# Altium project main_mini.PrjPcb
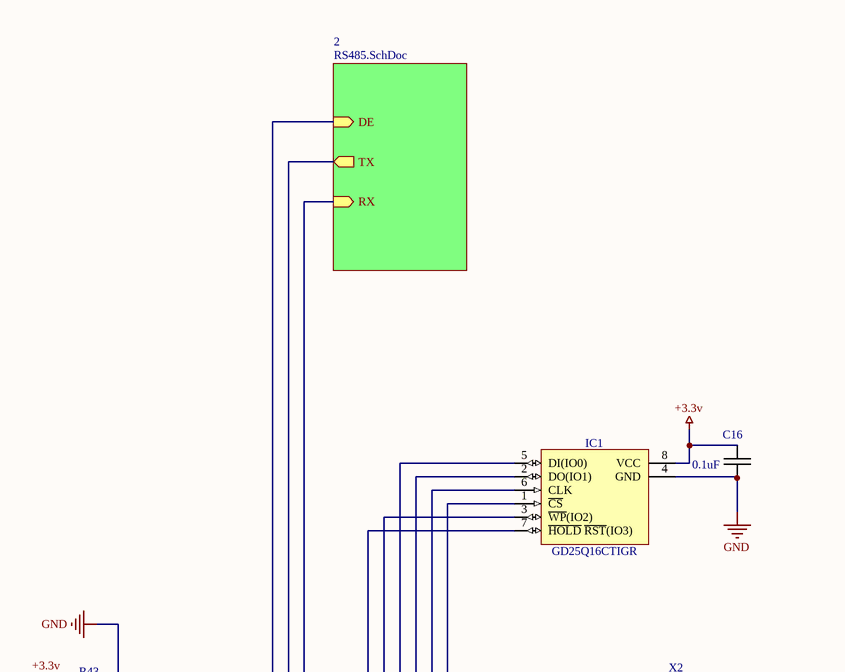
[diagram p0: main_mini.SchDoc, top left]
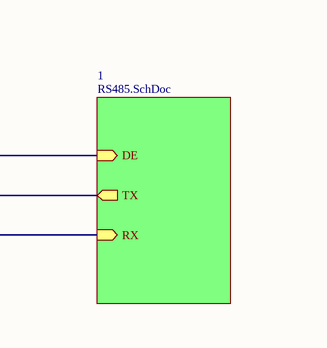
[diagram p1: main_mini.SchDoc, top right]
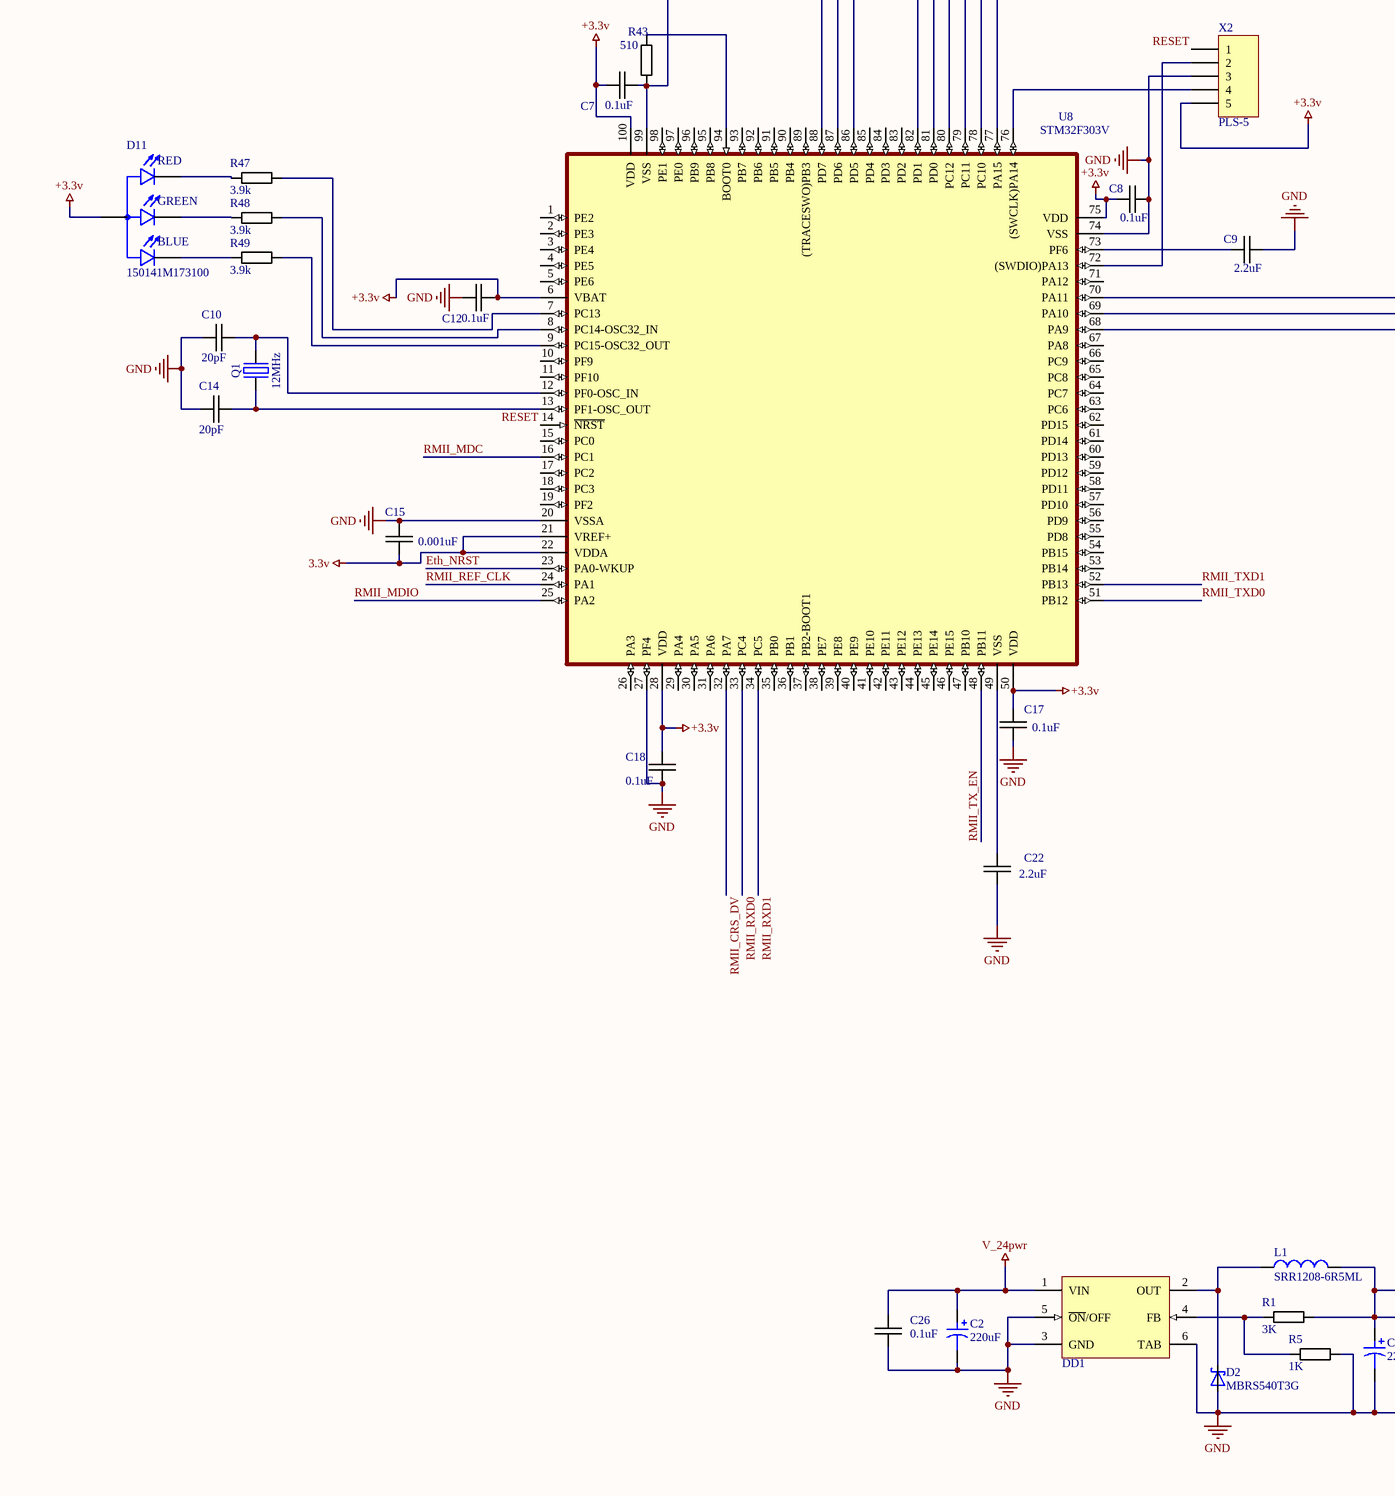
[diagram p2: main_mini.SchDoc, bottom left]
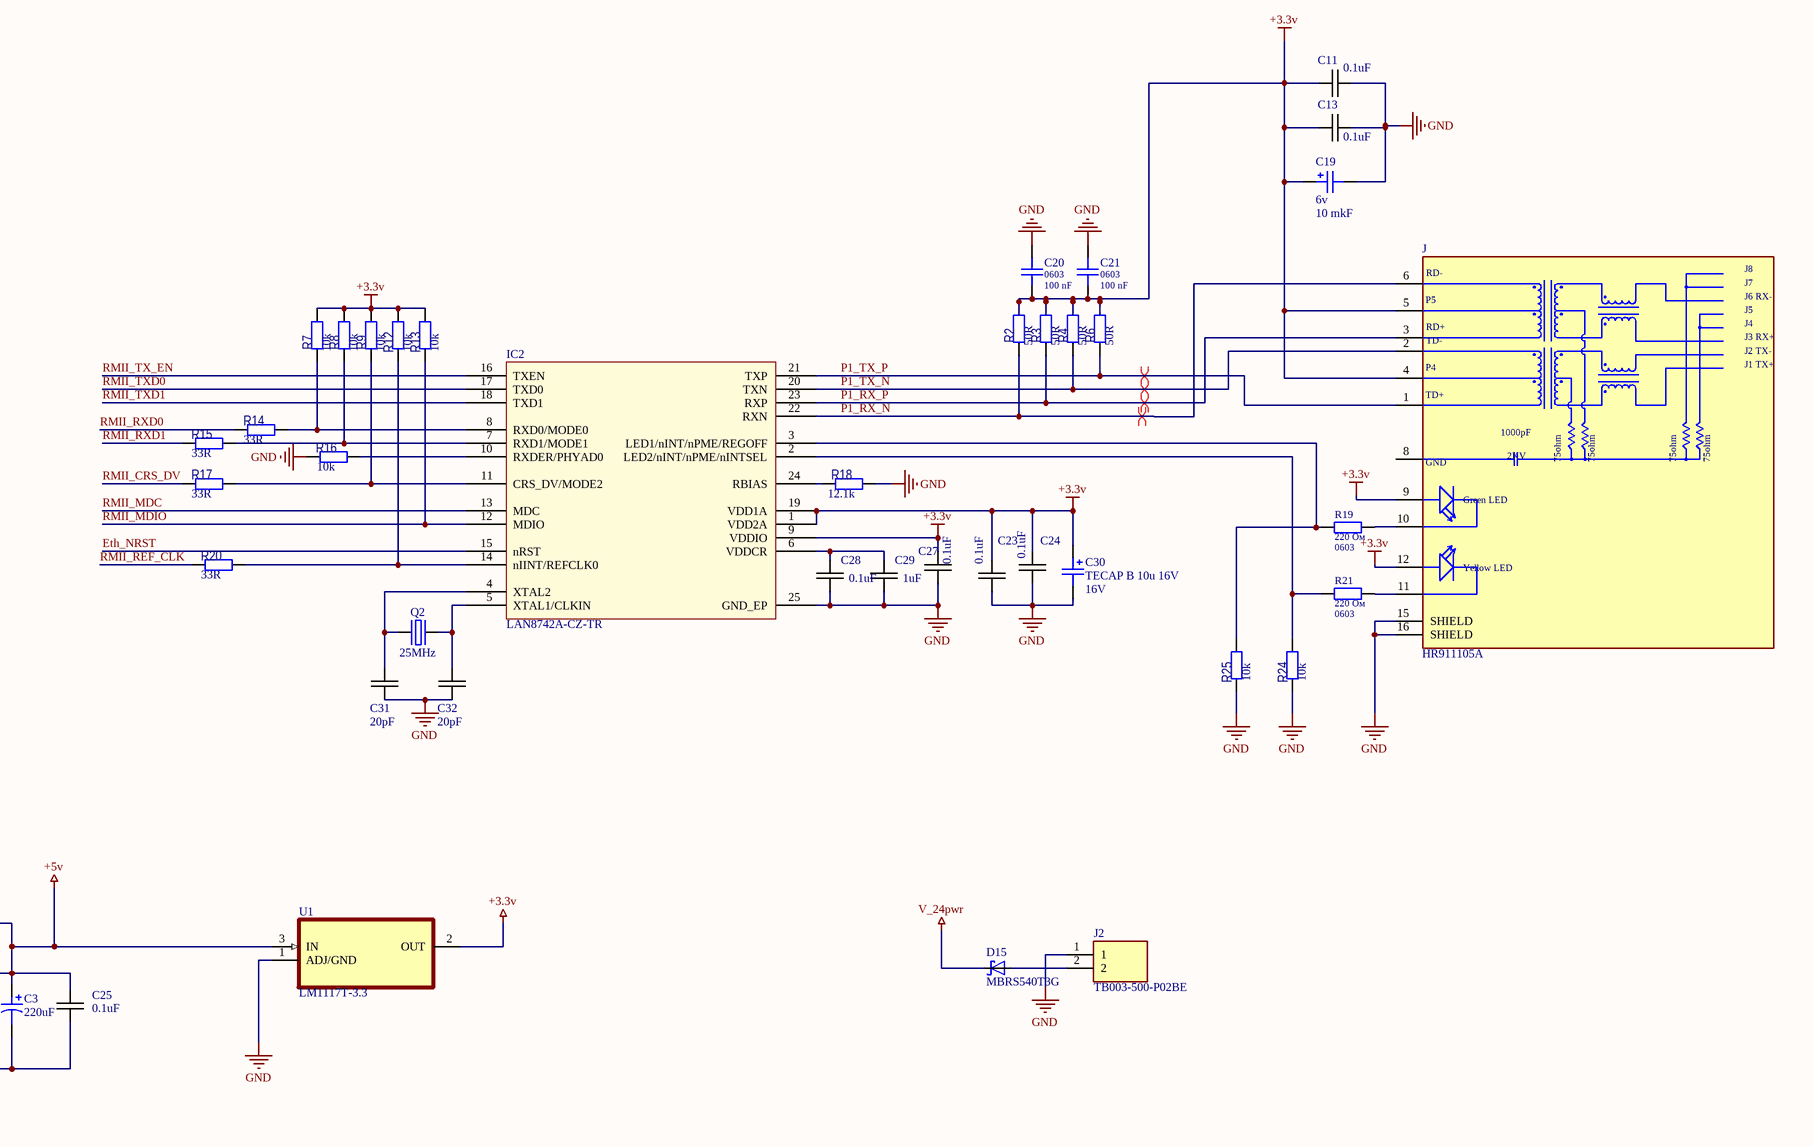
[diagram p3: main_mini.SchDoc, bottom right]
2 sheets, 97 parts. Net scope: hierarchical (ports join the sheet entries above them; power ports are global).
Board file: main_mini.PcbDoc
Sheets:
  main_mini.SchDoc
    2 = RS485.SchDoc
    1 = RS485.SchDoc

## Sheet main_mini.SchDoc
size A1

### Parts
C2  value 220uF  [ECR 10x13mm]  (hidden comment: 220uF 50v)
C3  value 220uF  [ECR 10x13mm]  (hidden comment: 220uF 50v)
C7  0.1uF  [CAPACITOR 0603]
C8  0.1uF  [CAPACITOR 0603]
C9  2.2uF  [CAPACITOR 0805]
C10  20pF  [CAPACITOR 0603]
C11  0.1uF  [CAPACITOR 0603]
C12  0.1uF  [CAPACITOR 0603]
C13  0.1uF  [CAPACITOR 0603]
C14  20pF  [CAPACITOR 0603]
C15  0.001uF  [CAPACITOR 0603]
C16  0.1uF  [CAPACITOR 0603]
C17  0.1uF  [CAPACITOR 0603]
C18  0.1uF  [CAPACITOR 0603]
C19  value 10 mkF  Voltage: 6v  [TECAP B]  (hidden comment: Cap T)
C20  Type: 0603  [CAPCHIP0603]  (hidden comment: 100 nF)
C21  Type: 0603  [CAPCHIP0603]  (hidden comment: 100 nF)
C22  2.2uF  [CAPACITOR 0805]
C23  0.1uF  [CAPACITOR 0603]
C24  0.1uF  [CAPACITOR 0603]
C25  0.1uF  [CAPACITOR 0603]
C26  0.1uF  [CAPACITOR 0603]
C27  0.1uF  [CAPACITOR 0603]
C28  0.1uF  [CAPACITOR 0603]
C29  1uF  [CAPACITOR 0603]
C30  Voltage: 16V  [TECAP B]  (hidden comment: TECAP B 10u 16V)
C31  20pF  [CAPACITOR 0603]
C32  20pF  [CAPACITOR 0603]
D2  MBRS540T3G  [DIOM7958X213N]
D11  150141M173100  [LED_150141M173100]
D15  MBRS540T3G  [DIOM7958X213N]
DD1  LM2596S-ADJ  [TO-263]  (value not drawn)
IC1  GD25Q16CTIGR  [NSO8]
IC2  LAN8742A-CZ-TR  [LAN8742A]
J  HR911105A  [HANRUN_HR911105A]
J2  TB003-500-P02BE  [CUI_TB003-500-P02BE]
L1  SRR1208-6R5ML  [SRR1208]
Q1  12MHz  [HC49SM]
Q2  25MHz  [HC49SM]
R1  3K  [Resistor 0603]
R2  50R  [RESCHIP0603]
R3  50R  [RESCHIP0603]
R4  50R  [RESCHIP0603]
R5  1K  [Resistor 0603]
R6  50R  [RESCHIP0603]
R7  10k  [RESCHIP0603]
R8  10k  [RESCHIP0603]
R9  10k  [RESCHIP0603]
R12  10k  [RESCHIP0603]
R13  10k  [RESCHIP0603]
R14  33R  [RESCHIP0603]
R15  33R  [RESCHIP0603]
R16  10k  [RESCHIP0603]
R17  33R  [RESCHIP0603]
R18  12.1k  [RESCHIP0603]
R19  Type: 0603  [RESCHIP0603]  (hidden comment: 220 Ом)
R20  33R  [RESCHIP0603]
R21  Type: 0603  [RESCHIP0603]  (hidden comment: 220 Ом)
R24  10k  [RESCHIP0603]
R25  10k  [RESCHIP0603]
R43  510  [Resistor 0805]
R47  3.9k  [Resistor 0805]
R48  3.9k  [Resistor 0805]
R49  3.9k  [Resistor 0805]
U1  LM1117T-3.3  [TO254P470X1016X2222-3P]
U8  STM32F303V  [QFP50P1600X1600X160-100N]
X2  PLS-5  [PLS-5-3D]

### Sub-sheets
1 = RS485.SchDoc: DE (in), TX (out), RX (in)
2 = RS485.SchDoc: DE (in), TX (out), RX (in)

### Nets
3.3v: C15.2 U8.21(VREF+) U8.22(VDDA)
+3.3v: C7.1 C8.1 C11.1 C12.2 C13.1 C16.1 C17.1 C18.1 C19.1 C20.1 C21.1 C23.1 C24.2 C27.1 C30.1 D11.1(A) IC1.8(VCC) IC2.1(VDD2A) IC2.9(VDDIO) IC2.19(VDD1A) J.4(P4) J.5(P5) J.9(GA) J.12(YA) R2.2 R3.2 R4.2 R6.2 R7.2 R8.2 R9.2 R12.2 R13.2 U1.2(OUT) U8.6(VBAT) U8.28(VDD) U8.50(VDD) U8.75(VDD) U8.100(VDD) X2.5
+5v: C3.1 C25.2 L1.P$2 R1.2 U1.3(IN)
GND: C2.2 C3.2 C7.2 C8.2 C9.2 C10.1 C11.2 C12.1 C13.2 C14.1 C15.1 C16.2 C17.2 C18.2 C19.2 C20.2 C21.2 C22.1 C23.2 C24.1 C25.1 C26.1 C27.2 C28.2 C29.2 C30.2 C31.1 C32.1 D2.A DD1.3(GND) DD1.5(~{ON}/OFF) DD1.6(TAB) IC1.4(GND) IC2.25(GND_EP) J.15(SHIELD) J.16(SHIELD) J2.1 R5.2 R16.1 R18.2 R24.1 R25.1 R43.2 U1.1(ADJ/GND) U8.20(VSSA) U8.27(PF4) U8.74(VSS) U8.99(VSS) X2.3
V_24pwr: C2.1 C26.2 D15.C DD1.1(VIN)
Eth_NRST: IC2.15(nRST) U8.23(PA0-WKUP)
P1_RX_N: IC2.22(RXN) J.6(RD-) R2.1
P1_RX_P: IC2.23(RXP) J.3(RD+) R3.1
P1_TX_N: IC2.20(TXN) J.2(TD-) R4.1
P1_TX_P: IC2.21(TXP) J.1(TD+) R6.1
RESET: U8.14(~{NRST}) X2.1
RMII_CRS_DV: R17.1 U8.32(PA7)
RMII_MDC: IC2.13(MDC) U8.16(PC1)
RMII_MDIO: IC2.12(MDIO) R13.1 U8.25(PA2)
RMII_REF_CLK: R20.1 U8.24(PA1)
RMII_RXD0: R14.1 U8.33(PC4)
RMII_RXD1: R15.1 U8.34(PC5)
RMII_TX_EN: IC2.16(TXEN) U8.48(PB11)
RMII_TXD0: IC2.17(TXD0) U8.51(PB12)
RMII_TXD1: IC2.18(TXD1) U8.52(PB13)
NetC9_1: C9.1 U8.73(PF6)
NetC10_2: C10.2 Q1.2(OSC2) U8.12(PF0-OSC_IN)
NetC14_2: C14.2 Q1.1(OSC1) U8.13(PF1-OSC_OUT)
NetC22_2: C22.2 U8.49(VSS)
NetC28_1: C28.1 C29.1 IC2.6(VDDCR)
NetC31_2: C31.2 IC2.4(XTAL2) Q2.1(OSC1)
NetC32_2: C32.2 IC2.5(XTAL1/CLKIN) Q2.2(OSC2)
NetD2_C: D2.C DD1.2(OUT) L1.P$1
NetD11_2: D11.2(B_C) R49.2
NetD11_3: D11.3(R_C) R47.2
NetD11_4: D11.4(G_C) R48.2
NetD15_A: D15.A J2.2
NetDD1_4: DD1.4(FB) R1.1 R5.1
NetIC1_1: IC1.1(~{CS}) U8.77(PA15)
NetIC1_2: IC1.2(DO(IO1)) U8.79(PC11)
NetIC1_3: IC1.3(~{WP}(IO2)) U8.81(PD0)
NetIC1_5: IC1.5(DI(IO0)) U8.80(PC12)
NetIC1_6: IC1.6(CLK) U8.78(PC10)
NetIC1_7: IC1.7(~{HOLD}_~{RST}(IO3)) U8.82(PD1)
NetIC2_2: IC2.2(LED2/nINT/nPME/nINTSEL) R21.1 R24.2
NetIC2_3: IC2.3(LED1/nINT/nPME/REGOFF) R19.1 R25.2
NetIC2_7: IC2.7(RXD1/MODE1) R8.1 R15.2
NetIC2_8: IC2.8(RXD0/MODE0) R7.1 R14.2
NetIC2_10: IC2.10(RXDER/PHYAD0) R16.2
NetIC2_11: IC2.11(CRS_DV/MODE2) R9.1 R17.2
NetIC2_14: IC2.14(nIINT/REFCLK0) R12.1 R20.2
NetIC2_24: IC2.24(RBIAS) R18.1
NetISO1_1_4: U8.70(PA11) ; sheet 1/DE
NetISO1_1_5: U8.68(PA9) ; sheet 1/RX
NetISO1_1_6: U8.69(PA10) ; sheet 1/TX
NetISO1_2_4: U8.88(PD7) ; sheet 2/DE
NetISO1_2_5: U8.86(PD5) ; sheet 2/RX
NetISO1_2_6: U8.87(PD6) ; sheet 2/TX
NetJ_10: J.10(GC) R19.2
NetJ_11: J.11(YC) R21.2
NetR43_1: R43.1 U8.94(BOOT0)
NetR47_1: R47.1 U8.7(PC13)
NetR48_1: R48.1 U8.8(PC14-OSC32_IN)
NetR49_1: R49.1 U8.9(PC15-OSC32_OUT)
NetU8_72: U8.72((SWDIO)PA13) X2.2
NetU8_76: U8.76((SWCLK)PA14) X2.4

Not connected (* = marked no-connect by the designer): J 8(GND); U8 1(PE2) 2(PE3) 3(PE4) 4(PE5) 5(PE6) 10(PF9) 11(PF10) 15(PC0) 17(PC2) 18(PC3) 19(PF2) 26(PA3) 29(PA4) 30(PA5) 31(PA6) 35(PB0) 36(PB1) 37(PB2-BOOT1) 38(PE7) 39(PE8) 40(PE9) 41(PE10) 42(PE11) 43(PE12) 44(PE13) 45(PE14) 46(PE15) 47(PB10) 53(PB14) 54(PB15) 55(PD8) 56(PD9) 57(PD10) 58(PD11) 59(PD12) 60(PD13) 61(PD14) 62(PD15) 63(PC6) 64(PC7) 65(PC8) 66(PC9) 67(PA8) 71(PA12) 83(PD2) 84(PD3) 85(PD4) 89((TRACESWO)PB3) 90(PB4) 91(PB5) 92(PB6) 93(PB7) 95(PB8) 96(PB9) 97(PE0) 98(PE1)

### Layout directives
differential pair: P1_RX_N, P1_RX_P, P1_TX_N, P1_TX_P

### Notes on the sheet
- (in symbol 150141M173100) RED; GREEN; BLUE
- (in symbol HR911105A) J8; J7; J6 RX-; J5; J4; J3 RX+; J2 TX-; J1 TX+; 1000pF; 2KV; 75ohm; Green LED; Yellow LED

### Library data of the parts
C2 C3 = Cap Pol: Polarized Capacitor (Rad); Voltage: 50; Type: Type; URL: http://www.hitano.com.tw/PDF/ECR_081225.pdf
C7-C18 C22-C29 C31 C32 = Capasitor: Value: *
C19 C30 = Cap T: Solid Tantalum Surface Mount Capacitors
  C19: Type: Type
  C30: Value: TECAP B 10u 16V; Type: TECAP B
C20 C21 = Cap C: Керамическтй конденсатор SMD C0603; Value: 100 nF
D2 D15 = MBRS540T3G: Diode Schottky 40V 5A Surface Mount SMC; MF: ON Semiconductor; SnapEDA_Link: https://www.snapeda.com/parts/MBRS540T3G/ON%20Semiconductor/view-part/78777/?ref=snap; MP: MBRS540T3G; Availability: Unavailable; Price: None; Value: *; Package: DO-214 ON Semiconductor
D11 = 150141M173100: Red, Green, Blue _RGB_ 625nm Red, 520nm Green, 470nm Blue LED Indication - Discrete 2V Red, 3.2V Green, 3.2V Blue 1411 _3528 Metric_; MF: Wurth Electronics; SnapEDA_Link: https://www.snapeda.com/parts/150141M173100/Wurth%20Electronics%20Inc./view-part/281733/?ref=snap; Price: None; MP: 150141M173100; Package: 1411 WÃ¼rth Elektronik; Value: *; Availability: Unavailable
DD1 = LM2596S-ADJ: SIMPLE SWITCHER® Power Converter 150 KHz 3A Step-Down Voltage Regulator, 5-pin TO-263; Manufacturer: National Semiconductor; Published: 13.04.2012; Publisher: Reukov A.V.; PartNumber: LM2596S-ADJ; CompType: Switcher; ComponentLink1URL: http://www.national.com/ds/LM/LM2596.pdf; ComponentLink2URL: http://www.national.com/pf/LM/LM2596.html; ComponentLink3URL: http://www.national.com/packaging/folders/ts5b.html
IC1 = W25Q128FVEIG: 128M-bit Serial Flash Memory with uniform 4KB sectors and Dual/Quad SPI and QPI
J = HR911105A: HR911105A Ethernet Interface Arduino Platform Evaluation Expansion Board; MF: DFRobot; Package: None; Availability: Unavailable; MP: HR911105A; Value: *; SnapEDA_Link: https://www.snapeda.com/parts/HR911105A/DFRobot/view-part/214807/?ref=snap; Price: None
J2 = TB003-500-P02BE: 2~24 Poles, Screw Type, Horizontal, 5.0 Pitch, 26~14 _AWG_, Terminal Block Connector; MF: CUI Devices; MP: TB003-500-P02BE; Availability: Unavailable; Package: None; SnapEDA_Link: https://www.snapeda.com/parts/TB003-500-P02BE/CUI%20Devices/view-part/3590637/?ref=snap; Price: None; Value: *
L1 = SRR1208-6R5ML: 6.5ÂµH Shielded Wirewound Inductor 6A 18mOhm Max Nonstandard; MF: Bourns; Availability: Unavailable; SnapEDA_Link: https://www.snapeda.com/parts/SRR1208-6R5ML/Bourns/view-part/353452/?ref=snap; Value: *; Package: Nonstandard Bourns; MP: SRR1208-6R5ML; Price: None
Q1 Q2 = Quartz Crystal
R1 R5 R43 R47-R49 = Resistor: Value: *
R2-R4 R6-R9 R12-R18 R20 R24 R25 = Res: Резистор; Tolerance_Percent: {Tolerance_Percent}; Class: Электронные компоненты; SubClass: Резисторы; Power_W: {Power_W}; Installation: {Installation}; Ordering_Information: {Ordering_Information}; Body: {Body}; Pins: 2
  R2-R4 R6: Value: 50R
  R7-R9 R12 R13 R16 R24 R25: Value: 10k
  R14 R15 R17 R20: Value: 33R
  R18: Value: 12.1k
R19 R21 = Res: Резистор SMD R0603; Tolerance: %; PWR: Value; Value: 220 Ом
U1 = LM1117T-3.3: Linear Voltage Regulator IC 1 Output 800mA TO-220-3; MF: Texas Instruments; MP: LM1117T-3.3; Price: None; Availability: Unavailable; Package: TO-220 Texas Instruments; SnapEDA_Link: https://www.snapeda.com/parts/LM1117T-3.3/Texas%20Instruments/view-part/103788/?ref=snap; Value: *
U8 = STM32F303V: ARMÂ® CortexÂ®-M4 STM32F3 Microcontroller IC 32-Bit 72MHz 100-LQFP (14x14); MF: STMicroelectronics; Price: None; Value: *; Availability: Unavailable; Package: LQFP-100 STMicroelectronics; MP: STM32F303V
X2 = PLS-5: Header, 5-Pin; LatestRevisionDate: 17-Jul-2002; LatestRevisionNote: Re-released for DXP Platform.; Publisher: Altium Limited

## Sheet RS485.SchDoc
size A1
Used 2 times, as channels 2, 1. Parts and nets are listed once, with the designators drawn on the sheet.
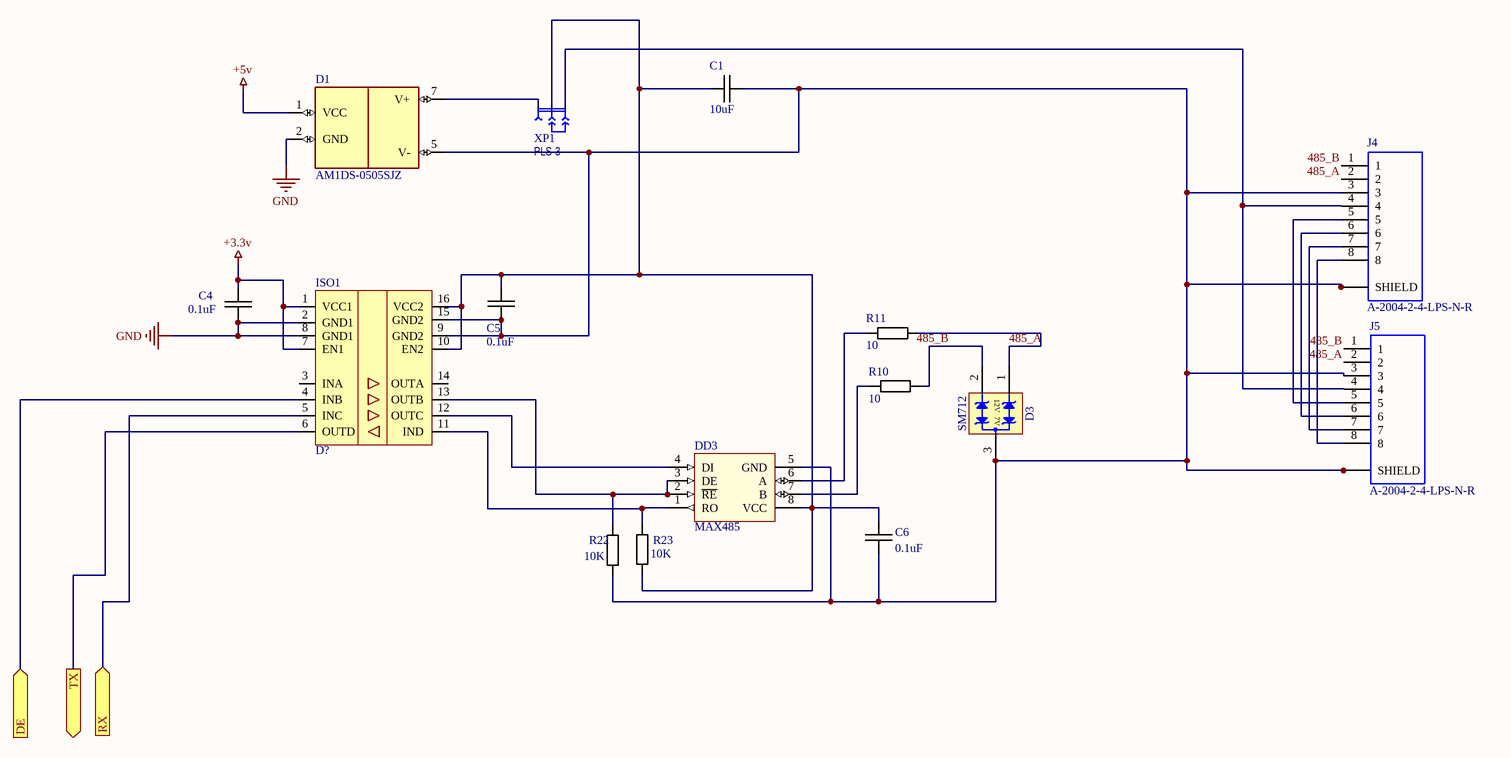
[diagram p4: RS485.SchDoc]

### Parts
C1  10uF  [CAPC3225X270N]
C4  0.1uF  [CAPACITOR 0603]
C5  0.1uF  [CAPACITOR 0603]
C6  0.1uF  [CAPACITOR 0603]
D1  AM1DS-0505SJZ  [AM2D-NZ]
D3  SM712  [SOT23]
DD3  MAX485  [NSO8]
ISO1  D?  [*SOIC127P1030X265-16N]
J4  A-2004-2-4-LPS-N-R  [ASSMANN_A-2004-2-4-LPS-N-R]
J5  A-2004-2-4-LPS-N-R  [ASSMANN_A-2004-2-4-LPS-N-R]
R10  10  [Resistor 0603]
R11  10  [Resistor 0603]
R22  10K  [Resistor 0603]
R23  10K  [Resistor 0603]
XP1  PLS-3  [ZL201-3]

### Ports
DE (in), RX (in), TX (out)

### Nets
+3.3v: C4.1 ISO1.1(VCC1) ISO1.7(EN1)
+5v: D1.1(VCC)
GND: C4.2 D1.2(GND) ISO1.2(GND1) ISO1.8(GND1)
485_A: D3.1(I/O1) J4.2 J5.2 R11.1
485_B: D3.2(I/O2) J4.1 J5.1 R10.1
DE: ISO1.4(INB) ; port DE
RX: ISO1.5(INC) ; port RX
TX: ISO1.6(OUTD) ; port TX
NetC1_1: C1.1 C5.1 C6.1 D1.5(V-) D3.3(GND) DD3.5(GND) ISO1.9(GND2) ISO1.15(GND2) J4.3 J4.S1(SHIELD) J4.S2(SHIELD) J5.3 J5.S1(SHIELD) J5.S2(SHIELD) R22.2
NetC1_2: C1.2 C5.2 C6.2 DD3.8(VCC) ISO1.10(EN2) ISO1.16(VCC2) R23.1 XP1.2
NetD1_7: D1.7(V+) XP1.3
NetDD3_1: DD3.1(RO) ISO1.11(IND) R23.2
NetDD3_2: DD3.2(~{RE}) DD3.3(DE) ISO1.13(OUTB) R22.1
NetDD3_4: DD3.4(DI) ISO1.12(OUTC)
NetDD3_6: DD3.6(A) R11.2
NetDD3_7: DD3.7(B) R10.2
NetJ4_4: J4.4 J5.4 XP1.1
NetJ4_5: J4.5 J5.5
NetJ4_6: J4.6 J5.6
NetJ4_7: J4.7 J5.7
NetJ4_8: J4.8 J5.8

Not connected (* = marked no-connect by the designer): ISO1 3(INA) 14(OUTA)

### Channels
2: designators end in _2; ports DE=NetISO1_2_4 RX=NetISO1_2_5 TX=NetISO1_2_6
1: designators end in _1; ports DE=NetISO1_1_4 RX=NetISO1_1_5 TX=NetISO1_1_6

### Notes on the sheet
- (in symbol SM712) 12V; 7V

### Library data of the parts
C1 C4-C6 = Capasitor: Value: *
D3 = SM712: Asymmetrical TVS Diode for Extended Common-Mode RS-485
DD3 = MAX485: Low-Power, Slew-Rate-Limited RS-485/RS-422 Transceiver; ComponentLink1URL: http://pdfserv.maxim-ic.com/en/ds/MAX1487-MAX491.pdf; Type: MAX485
ISO1 = ISO7341
J4 J5 = A-2004-2-4-LPS-N-R: Jack Modular Connector 8p8c _RJ45, Ethernet_ 90Â° Angle _Right_ Shielded; MF: Assmann WSW; Package: None; MP: A-2004-2-4-LPS-N-R; Value: *; Price: None; Availability: Unavailable; SnapEDA_Link: https://www.snapeda.com/parts/A-2004-2-4-LPS-N-R/Assmann%20WSW%20Components/view-part/454861/?ref=snap
R10 R11 R22 R23 = Resistor: Value: *
XP1 = Select jump: Connector, 3-Pin; Class: Электронные компоненты; SubClass: Разъемы; Pitch_mm: {Pitch_mm}; Installation: DIP; Ordering_Information: {Ordering_Information}; Type_of_connector: {Type_of_connector}; Pins: 3; Value: PLS-3

## Nets that join several sheets
+3.3v: main_mini (40 pins), 2 (C4_2.1 ISO1_2.1 ISO1_2.7), 1 (C4_1.1 ISO1_1.1 ISO1_1.7)
+5v: main_mini (5 pins), 2 (D1_2.1), 1 (D1_1.1)
GND: main_mini (49 pins), 2 (C4_2.2 D1_2.2 ISO1_2.2 ISO1_2.8), 1 (C4_1.2 D1_1.2 ISO1_1.2 ISO1_1.8)
NetISO1_1_4: main_mini (U8.70), 1 (ISO1_1.4)
NetISO1_1_5: main_mini (U8.68), 1 (ISO1_1.5)
NetISO1_1_6: main_mini (U8.69), 1 (ISO1_1.6)
NetISO1_2_4: main_mini (U8.88), 2 (ISO1_2.4)
NetISO1_2_5: main_mini (U8.86), 2 (ISO1_2.5)
NetISO1_2_6: main_mini (U8.87), 2 (ISO1_2.6)